# Altium schematic sheet mosfet.SchDoc
size A4
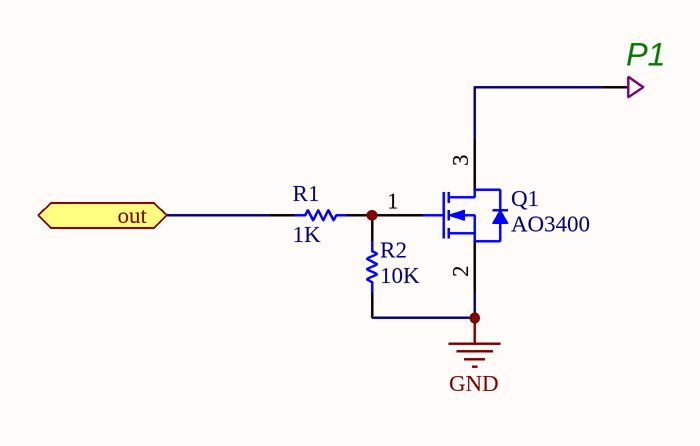
[diagram p0: mosfet.SchDoc]

## Parts
P1  pin  [pin]  (value not drawn)
Q1  AO3400  [AO-SOT23-3_V]
R1  1K  [RESC2013X70X40ML20T20]
R2  10K  [RESC2013X70X40ML20T20]

## Ports
out

## Nets
GND: Q1.2(S) R2.2
out: R1.2 ; port out
NetP1_0: P1.0 Q1.3(D)
NetQ1_1: Q1.1(G) R1.1 R2.1

## Library data of the parts
Q1 = CMP-0278-00001-1: N-channel Enhancement Mode Field-Effect Transistor; 5.8A/30V; Manufacturer: Alpha and Omega; Channel Type: N; Drain-Source Voltage Limit: 30 V; Junction Temperature: -55 to 150 degC; Gate-Source Voltage Limit: +/-12 V; PackageDescription: 3-Pin SOT23, 3.016 x 2.8 mm Body, 0.95 mm Pitch; ComponentLink2Description: Datasheet; DatasheetVersion: Rev.8, 12/2011; ComponentLink3URL: http://www.aosmd.com/res/packaging_information/SOT-23.pdf; Storage Temperature: -55 to 150 degC; ComponentLink3Description: Package Specification; PackageReference: SOT23; ComponentLink1Description: Manufacturer URL; Mounting Technology: Surface Mount; ComponentLink1URL: http://www.aosmd.com/; PartNumber: AO3400; ComponentLink2URL: http://www.aosmd.com/res/data_sheets/AO3400.pdf
R1 R2 = CMP-2001-04440-2: RES SMD 150K OHM 1% 1/8W 0805; Manufacturer: Panasonic; Part Number: ERJ-6ENF1503V; Case-EIA: 0805; Datasheet: http://industrial.panasonic.com/cdbs/www-data/pdf/RDA0000/AOA0000C86.pdf